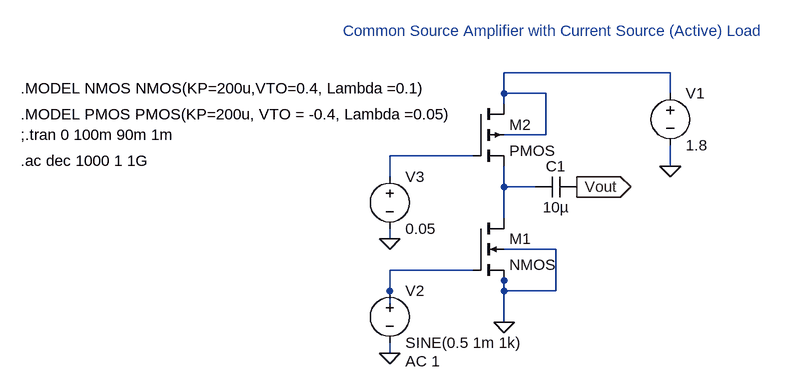
[diagram p0: schematic CS_Amplifier_Current_Source_load.asc]
CS_Amplifier_Current_Source_load.asc, the LTspice schematic file:
Version 4
SHEET 1 880 680
WIRE 448 -64 192 -64
WIRE 192 -32 192 -64
WIRE 256 -32 192 -32
WIRE 448 -32 448 -64
WIRE 192 -16 192 -32
WIRE 256 32 256 -32
WIRE 256 32 192 32
WIRE 144 64 16 64
WIRE 448 80 448 48
WIRE 16 96 16 64
WIRE 192 112 192 80
WIRE 240 112 192 112
WIRE 192 160 192 112
WIRE 16 192 16 176
WIRE 272 208 192 208
WIRE 144 240 16 240
WIRE 192 256 192 240
WIRE 16 272 16 240
WIRE 192 272 192 256
WIRE 272 272 272 208
WIRE 272 272 192 272
WIRE 16 304 16 272
WIRE 192 320 192 272
WIRE 16 368 16 352
FLAG 192 320 0
FLAG 16 368 0
FLAG 448 80 0
FLAG 304 112 Vout
IOPIN 304 112 Out
FLAG 16 192 0
SYMBOL nmos4 144 160 R0
SYMATTR InstName M1
SYMATTR Value2 l=0.18u w=3.6u
SYMBOL pmos4 144 -16 R0
SYMATTR InstName M2
SYMATTR Value2 l=10u w=1u
SYMBOL voltage 448 -48 R0
WINDOW 123 0 0 Left 0
WINDOW 39 0 0 Left 0
SYMATTR InstName V1
SYMATTR Value 1.8
SYMBOL voltage 16 256 R0
WINDOW 123 24 124 Left 2
WINDOW 39 0 0 Left 0
SYMATTR Value2 AC 1
SYMATTR InstName V2
SYMATTR Value SINE(0.5 1m 1k)
SYMBOL cap 304 96 R90
WINDOW 0 0 32 VBottom 2
WINDOW 3 32 32 VTop 2
SYMATTR InstName C1
SYMATTR Value 10µ
SYMBOL voltage 16 80 R0
WINDOW 123 0 0 Left 0
WINDOW 39 0 0 Left 0
SYMATTR InstName V3
SYMATTR Value 0.05
TEXT -552 -40 Left 2 !.MODEL NMOS NMOS(KP=200u,VTO=0.4, Lambda =0.1)
TEXT -552 32 Left 2 !;.tran 0 100m 90m 1m
TEXT -552 0 Left 2 !.MODEL PMOS PMOS(KP=200u, VTO = -0.4, Lambda =0.05)
TEXT -56 -128 Left 2 ;Common Source Amplifier with Current Source (Active) Load
TEXT -552 72 Left 2 !.ac dec 1000 1 1G

The netlist it stands for:
* CS_Amplifier_Current_Source_load.asc
M1 N003 N004 0 0 NMOS l=0.18u w=3.6u
M2 N001 N002 N003 N001 PMOS l=10u w=1u
V1 N001 0 1.8
V2 N004 0 SINE(0.5 1m 1k) AC 1
C1 Vout N003 10µ
V3 N002 0 0.05
.model NMOS NMOS
.model PMOS PMOS
.lib standard.mos
.MODEL NMOS NMOS(KP=200u,VTO=0.4, Lambda =0.1)
;.tran 0 100m 90m 1m
.MODEL PMOS PMOS(KP=200u, VTO = -0.4, Lambda =0.05)
* Common Source Amplifier with Current Source (Active) Load
.ac dec 1000 1 1G
.backanno
.end